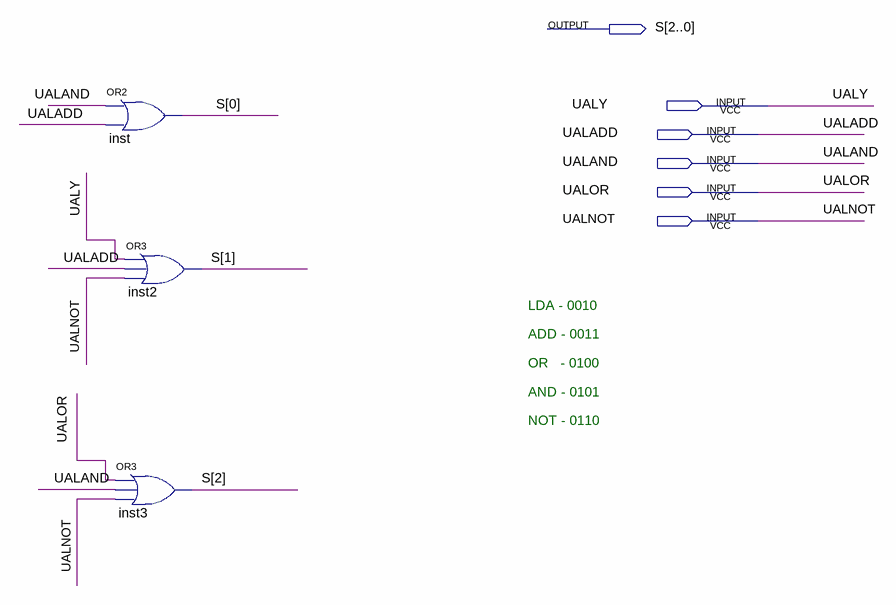
[diagram p0: schematic sheet]
// Quartus schematic CODULA8b3b.bdf as structural Verilog: 3 symbols, 6 pins
module CODULA8b3b (
  input  UALY,
  input  UALADD,
  input  UALAND,
  input  UALOR,
  input  UALNOT,
  output [2:0] S
);

  or inst (S[0], UALAND, UALADD);
  or inst2 (S[1], UALY, UALADD, UALNOT);
  or inst3 (S[2], UALOR, UALAND, UALNOT);

  // Notes on the sheet:
  //   LDA - 0010
  //   ADD - 0011
  //   OR   - 0100
  //   AND - 0101
  //   NOT - 0110
endmodule
